# Altium schematic sheet led_matrix.SchDoc
size A4
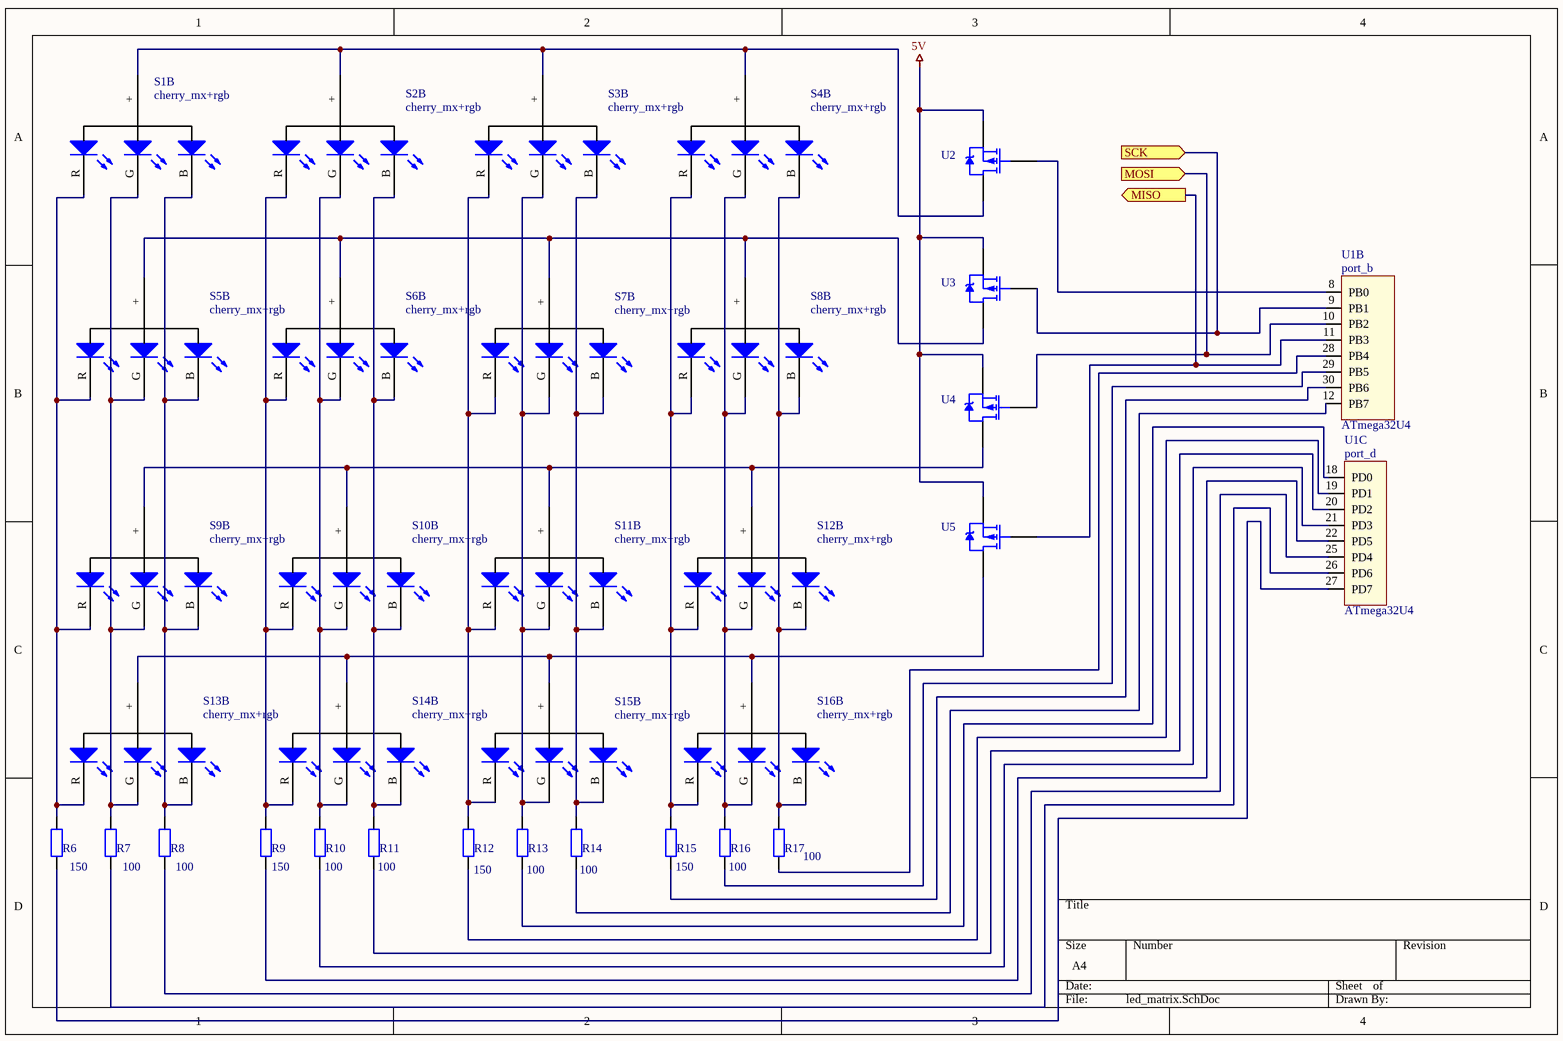
[diagram p0: led_matrix.SchDoc]

## Parts
R6  150  [0805]
R7  100  [0805]
R8  100  [0805]
R9  150  [0805]
R10  100  [0805]
R11  100  [0805]
R12  150  [0805]
R13  100  [0805]
R14  100  [0805]
R15  150  [0805]
R16  100  [0805]
R17  100  [0805]
S1  cherry_mx+rgb  [kailh_socket_mx+led]  (part B of 2)
S2  cherry_mx+rgb  [kailh_socket_mx+led]  (part B of 2)
S3  cherry_mx+rgb  [kailh_socket_mx+led]  (part B of 2)
S4  cherry_mx+rgb  [kailh_socket_mx+led]  (part B of 2)
S5  cherry_mx+rgb  [kailh_socket_mx+led]  (part B of 2)
S6  cherry_mx+rgb  [kailh_socket_mx+led]  (part B of 2)
S7  cherry_mx+rgb  [kailh_socket_mx+led]  (part B of 2)
S8  cherry_mx+rgb  [kailh_socket_mx+led]  (part B of 2)
S9  cherry_mx+rgb  [kailh_socket_mx+led]  (part B of 2)
S10  cherry_mx+rgb  [kailh_socket_mx+led]  (part B of 2)
S11  cherry_mx+rgb  [kailh_socket_mx+led]  (part B of 2)
S12  cherry_mx+rgb  [kailh_socket_mx+led]  (part B of 2)
S13  cherry_mx+rgb  [kailh_socket_mx+led]  (part B of 2)
S14  cherry_mx+rgb  [kailh_socket_mx+led]  (part B of 2)
S15  cherry_mx+rgb  [kailh_socket_mx+led]  (part B of 2)
S16  cherry_mx+rgb  [kailh_socket_mx+led]  (part B of 2)
U1  ATmega32U4  [QFN44P05P7X7]  (parts B,C of 5)
U2  P-mosfet_NX300PBK  [SOT23(TO-236AB)P095S230x290]  (value not drawn)
U3  P-mosfet_NX300PBK  [SOT23(TO-236AB)P095S230x290]  (value not drawn)
U4  P-mosfet_NX300PBK  [SOT23(TO-236AB)P095S230x290]  (value not drawn)
U5  P-mosfet_NX300PBK  [SOT23(TO-236AB)P095S230x290]  (value not drawn)

## Ports
MISO (out), MOSI (in), SCK (in)

## Nets
5V: U2.2(S) U3.2(S) U4.2(S) U5.2(S)
MISO: U1.11(PB3) U5.1(G) ; port MISO
MOSI: U1.10(PB2) U4.1(G) ; port MOSI
SCK: U1.9(PB1) U3.1(G) ; port SCK
NetR6_1: R6.1 U1.27(PD7)
NetR6_2: R6.2 S1.R S5.R S9.R S13.R
NetR7_1: R7.1 U1.26(PD6)
NetR7_2: R7.2 S1.G S5.G S9.G S13.G
NetR8_1: R8.1 U1.25(PD4)
NetR8_2: R8.2 S1.B S5.B S9.B S13.B
NetR9_1: R9.1 U1.22(PD5)
NetR9_2: R9.2 S2.R S6.R S10.R S14.R
NetR10_1: R10.1 U1.21(PD3)
NetR10_2: R10.2 S2.G S6.G S10.G S14.G
NetR11_1: R11.1 U1.20(PD2)
NetR11_2: R11.2 S2.B S6.B S10.B S14.B
NetR12_1: R12.1 U1.19(PD1)
NetR12_2: R12.2 S3.R S7.R S11.R S15.R
NetR13_1: R13.1 U1.18(PD0)
NetR13_2: R13.2 S3.G S7.G S11.G S15.G
NetR14_1: R14.1 U1.12(PB7)
NetR14_2: R14.2 S3.B S7.B S11.B S15.B
NetR15_1: R15.1 U1.30(PB6)
NetR15_2: R15.2 S4.R S8.R S12.R S16.R
NetR16_1: R16.1 U1.29(PB5)
NetR16_2: R16.2 S4.G S8.G S12.G S16.G
NetR17_1: R17.1 U1.28(PB4)
NetR17_2: R17.2 S4.B S8.B S12.B S16.B
NetS1_+: S1.+ S2.+ S3.+ S4.+ U2.3(D)
NetS5_+: S5.+ S6.+ S7.+ S8.+ U3.3(D)
NetS9_+: S9.+ S10.+ S11.+ S12.+ U4.3(D)
NetS13_+: S13.+ S14.+ S15.+ S16.+ U5.3(D)
NetU1_8: U1.8(PB0) U2.1(G)

## Notes on the sheet
- (in symbol ATmega32U4, part B) port_b
- (in symbol ATmega32U4, part C) port_d

## Library data of the parts
R6-R17 = res0805